# Altium schematic sheet clock1.SchDoc
size A4
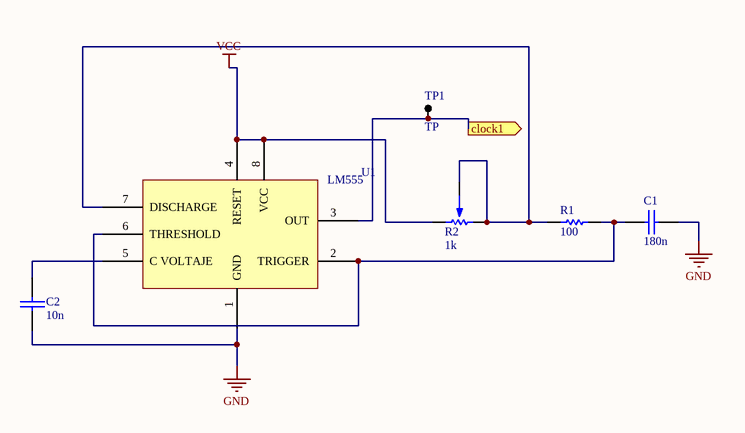
[diagram p0: clock1.SchDoc]

## Parts
C1  180n  [0805]
C2  10n  [CAP200]
R1  100  [0805]
R2  1k  [PRESET H]
TP1  TP  [TPTH]
U1  LM555  [DIP8]

## Ports
clock1 (out)

## Nets
GND: C1.2 C2.1 U1.1(GND)
VCC: R2.1 U1.4(RESET) U1.8(VCC)
clock1: TP1.1 U1.3(OUT) ; port clock1
NetC1_1: C1.1 R1.2 U1.2(TRIGGER) U1.6(THRESHOLD)
NetC2_2: C2.2 U1.5(C_VOLTAJE)
NetR1_1: R1.1 R2.2 R2.3 U1.7(DISCHARGE)

## Library data of the parts
C1 C2 = CAP
R1 = RES
R2 = PRESET
U1 = LM555: Timer